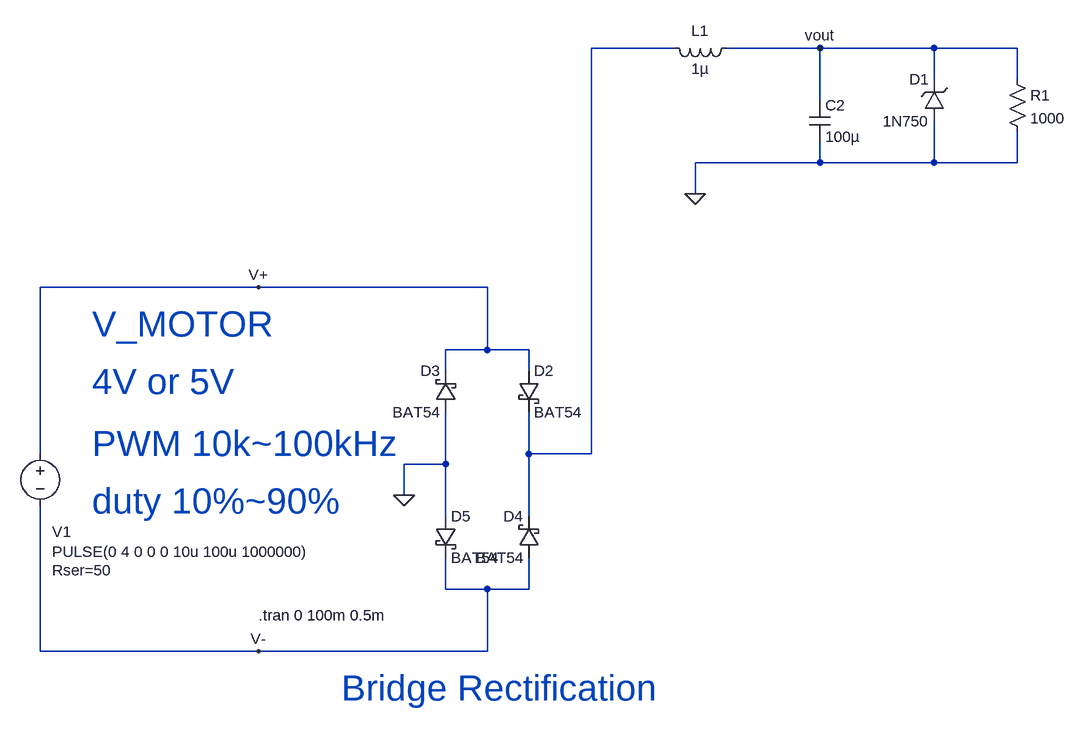
[diagram p0: schematic PLC_power.asc]
PLC_power.asc, the LTspice schematic file:
Version 4
SHEET 1 1500 800
WIRE -512 -560 -640 -560
WIRE -288 -560 -432 -560
WIRE -112 -560 -288 -560
WIRE 16 -560 -112 -560
WIRE -112 -512 -112 -560
WIRE 16 -512 16 -560
WIRE -288 -480 -288 -560
WIRE -288 -384 -288 -416
WIRE -288 -384 -480 -384
WIRE -112 -384 -112 -448
WIRE -112 -384 -288 -384
WIRE 16 -384 16 -432
WIRE 16 -384 -112 -384
WIRE -480 -336 -480 -384
WIRE -1152 -192 -1488 -192
WIRE -800 -192 -1152 -192
WIRE -800 -96 -800 -192
WIRE -800 -96 -864 -96
WIRE -736 -96 -800 -96
WIRE -864 -64 -864 -96
WIRE -736 -64 -736 -96
WIRE -1488 64 -1488 -192
WIRE -736 64 -736 0
WIRE -640 64 -640 -560
WIRE -640 64 -736 64
WIRE -864 80 -864 0
WIRE -864 80 -928 80
WIRE -928 128 -928 80
WIRE -864 160 -864 80
WIRE -736 160 -736 64
WIRE -864 272 -864 224
WIRE -800 272 -864 272
WIRE -736 272 -736 224
WIRE -736 272 -800 272
WIRE -1488 368 -1488 144
WIRE -1152 368 -1488 368
WIRE -800 368 -800 272
WIRE -800 368 -1152 368
FLAG -928 128 0
FLAG -1152 -192 V+
FLAG -1152 368 V-
FLAG -480 -336 0
FLAG -288 -560 vout
SYMBOL voltage -1488 48 R0
WINDOW 0 18 136 Left 2
WINDOW 3 18 167 Left 2
WINDOW 123 0 0 Left 0
WINDOW 39 18 195 Left 2
SYMATTR InstName V1
SYMATTR Value PULSE(0 4 0 0 0 10u 100u 1000000)
SYMATTR SpiceLine Rser=50
SYMBOL schottky -848 0 R180
WINDOW 0 24 64 Left 2
WINDOW 3 24 0 Left 2
SYMATTR InstName D3
SYMATTR Value BAT54
SYMATTR Description Diode
SYMATTR Type diode
SYMBOL schottky -752 -64 R0
SYMATTR InstName D2
SYMATTR Value BAT54
SYMATTR Description Diode
SYMATTR Type diode
SYMBOL schottky -720 224 R180
WINDOW 0 24 64 Left 2
WINDOW 3 24 0 Left 2
SYMATTR InstName D4
SYMATTR Value BAT54
SYMATTR Description Diode
SYMATTR Type diode
SYMBOL schottky -880 160 R0
SYMATTR InstName D5
SYMATTR Value BAT54
SYMATTR Description Diode
SYMATTR Type diode
SYMBOL ind -416 -576 R90
WINDOW 0 5 56 VBottom 2
WINDOW 3 32 56 VTop 2
SYMATTR InstName L1
SYMATTR Value 1µ
SYMBOL cap -304 -480 R0
SYMATTR InstName C2
SYMATTR Value 100µ
SYMBOL zener -96 -448 R180
WINDOW 0 24 64 Left 2
WINDOW 3 24 0 Left 2
SYMATTR InstName D1
SYMATTR Value 1N750
SYMATTR Description Diode
SYMATTR Type diode
SYMBOL res 0 -528 R0
SYMATTR InstName R1
SYMATTR Value 1000
TEXT -1152 312 Left 2 !.tran 0 100m 0.5m
TEXT -1408 -136 Left 5 ;V_MOTOR
TEXT -1408 -48 Left 5 ;4V or 5V
TEXT -1408 48 Left 5 ;PWM 10k~100kHz
TEXT -1408 136 Left 5 ;duty 10%~90%
TEXT -1024 424 Left 5 ;Bridge Rectification

The netlist it stands for:
* PLC_power.asc
V1 V+ V- PULSE(0 4 0 0 0 10u 100u 1000000) Rser=50
D3 0 V+ BAT54
D2 V+ N001 BAT54
D4 V- N001 BAT54
D5 0 V- BAT54
L1 vout N001 1µ
C2 vout 0 100µ
D1 0 vout 1N750
R1 vout 0 1000
.model D D
.lib standard.dio
.tran 0 100m 0.5m
* V_MOTOR
* 4V or 5V
* PWM 10k~100kHz
* duty 10%~90%
* Bridge Rectification
.backanno
.end